# Altium project PCB_Project1.PrjPCB
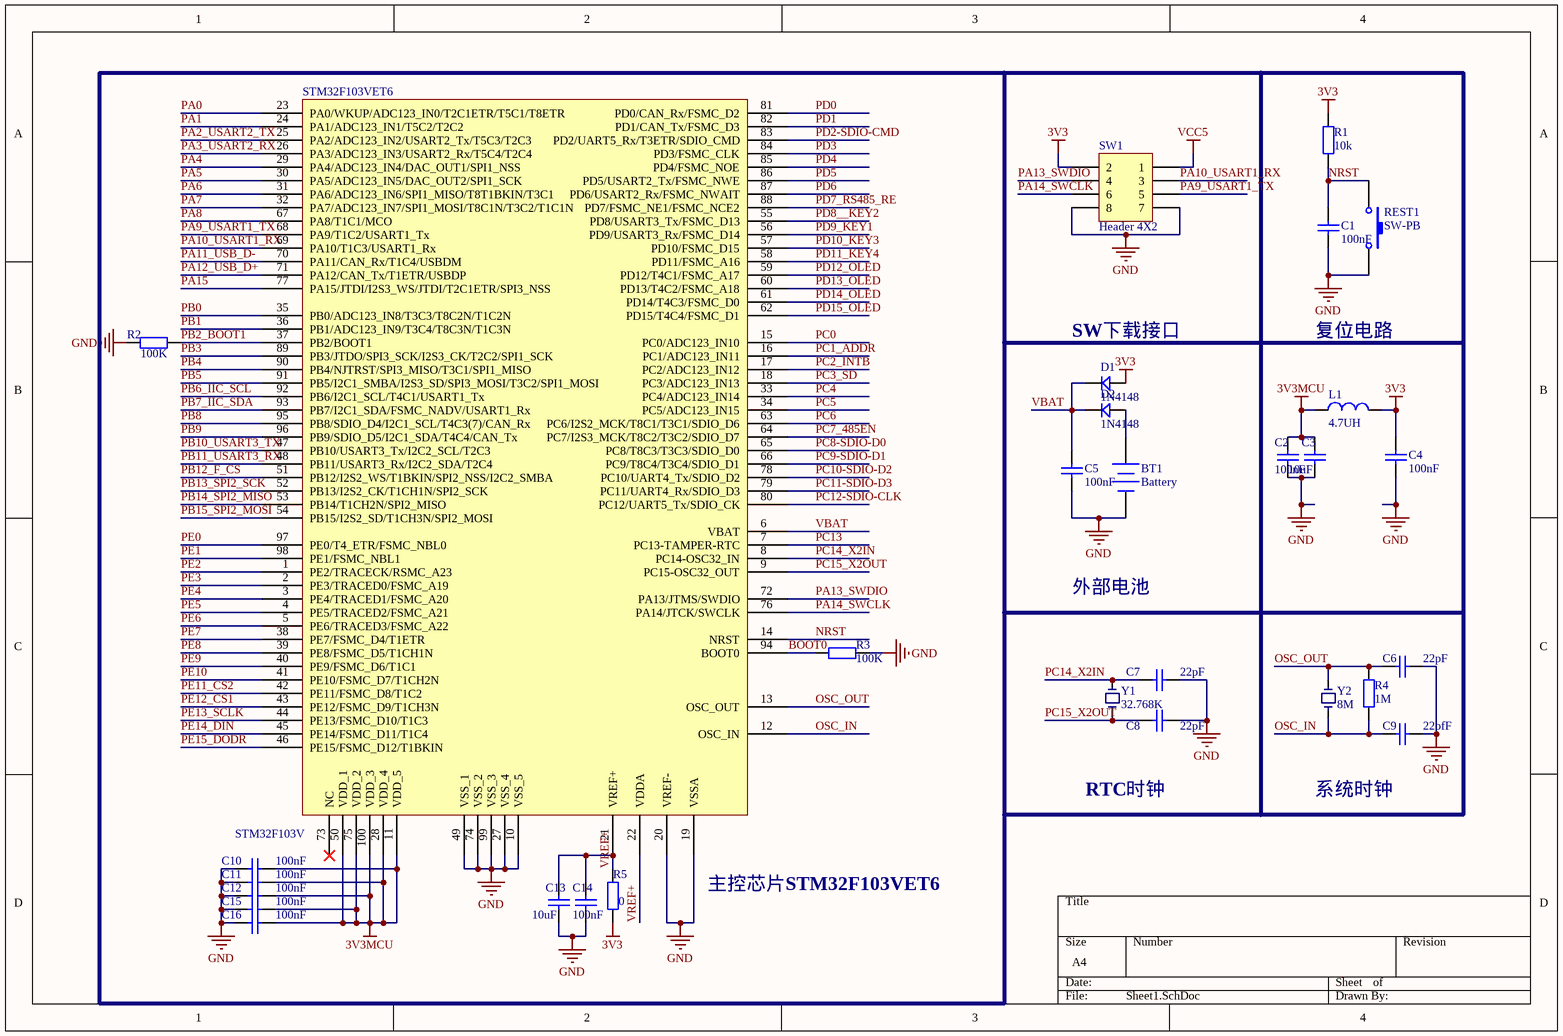
[diagram p0: Sheet1.SchDoc]
5 sheets, 202 parts. Net scope: global (net labels, ports and power ports of the same name join across sheets).
Board file: zhukong.PcbDoc
Sheets:
  Sheet1.SchDoc
  Sheet2.SchDoc
  Sheet3.SchDoc
  Sheet4.SchDoc
  Sheet5.SchDoc

## Sheet Sheet1.SchDoc
size A4

### Parts
BT1  Battery  [BATTERY_CR1220]
C1  100nF  [LC-0603_C]
C2  100nF  [LC-0603_C]
C3  10uF  [LC-0805_C]
C4  100nF  [LC-0603_C]
C5  100nF  [LC-0603_C]
C6  22pF  [LC-0603_C]
C7  22pF  [LC-0603_C]
C8  22pF  [LC-0603_C]
C9  22pfF  [LC-0603_C]
C10  100nF  [LC-0603_C]
C11  100nF  [LC-0603_C]
C12  100nF  [LC-0603_C]
C13  10uF  [LC-0805_C]
C14  100nF  [LC-0603_C]
C15  100nF  [LC-0603_C]
C16  100nF  [LC-0603_C]
D1  1N4148  [DIODE_SOP]
D2  1N4148  [DIODE_SOP]
L1  4.7UH  [LC-0805_L]
R1  10k  [LC-0603_R]
R2  100K  [LC-0603_R]
R3  100K  [LC-0603_R]
R4  1M  [LC-0603_R]
R5  0  [LC-0603_R]
REST1  SW-PB  [SW-SMD1]
STM32F103VET6  STM32F103V  [LQFP-100_M]
SW1  Header 4X2  [HDR2X4]
Y1  32.768K  [XTAL-长形 贴片]
Y2  8M  [XTAL 直插]

### Nets
3V3: C4.2 D1.1 L1.2 R1.1 R5.1 SW1.2
3V3MCU: C2.2 C3.2 C10.2 C11.2 C12.2 C15.2 C16.2 L1.1 STM32F103VET6.11(VDD_5) STM32F103VET6.28(VDD_4) STM32F103VET6.50(VDD_1) STM32F103VET6.75(VDD_2) STM32F103VET6.100(VDD_3)
GND: BT1.2(-) C1.2 C2.1 C3.1 C4.1 C5.1 C6.2 C7.2 C8.2 C9.2 C10.1 C11.1 C12.1 C13.1 C14.1 C15.1 C16.1 R2.2 R3.1 REST1.2 STM32F103VET6.10(VSS_5) STM32F103VET6.19(VSSA) STM32F103VET6.20(VREF-) STM32F103VET6.27(VSS_4) STM32F103VET6.49(VSS_1) STM32F103VET6.74(VSS_2) STM32F103VET6.99(VSS_3) SW1.7 SW1.8
VCC5: SW1.1
BOOT0: R3.2 STM32F103VET6.94(BOOT0)
NRST: C1.1 R1.2 REST1.1 STM32F103VET6.14(NRST)
OSC_IN: C9.1 R4.1 STM32F103VET6.12(OSC_IN) Y2.1
OSC_OUT: C6.1 R4.2 STM32F103VET6.13(OSC_OUT) Y2.2
PA0: STM32F103VET6.23(PA0/WKUP/ADC123_IN0/T2C1ETR/T5C1/T8ETR)
PA1: STM32F103VET6.24(PA1/ADC123_IN1/T5C2/T2C2)
PA2_USART2_TX: STM32F103VET6.25(PA2/ADC123_IN2/USART2_Tx/T5C3/T2C3)
PA3_USART2_RX: STM32F103VET6.26(PA3/ADC123_IN3/USART2_Rx/T5C4/T2C4)
PA4: STM32F103VET6.29(PA4/ADC123_IN4/DAC_OUT1/SPI1_NSS)
PA5: STM32F103VET6.30(PA5/ADC123_IN5/DAC_OUT2/SPI1_SCK)
PA6: STM32F103VET6.31(PA6/ADC123_IN6/SPI1_MISO/T8T1BKIN/T3C1)
PA7: STM32F103VET6.32(PA7/ADC123_IN7/SPI1_MOSI/T8C1N/T3C2/T1C1N)
PA8: STM32F103VET6.67(PA8/T1C1/MCO)
PA9_USART1_TX: STM32F103VET6.68(PA9/T1C2/USART1_Tx) SW1.5
PA10_USART1_RX: STM32F103VET6.69(PA10/T1C3/USART1_Rx) SW1.3
PA11_USB_D-: STM32F103VET6.70(PA11/CAN_Rx/T1C4/USBDM)
PA12_USB_D+: STM32F103VET6.71(PA12/CAN_Tx/T1ETR/USBDP)
PA13_SWDIO: STM32F103VET6.72(PA13/JTMS/SWDIO) SW1.4
PA14_SWCLK: STM32F103VET6.76(PA14/JTCK/SWCLK) SW1.6
PA15: STM32F103VET6.77(PA15/JTDI/I2S3_WS/JTDI/T2C1ETR/SPI3_NSS)
PB0: STM32F103VET6.35(PB0/ADC123_IN8/T3C3/T8C2N/T1C2N)
PB1: STM32F103VET6.36(PB1/ADC123_IN9/T3C4/T8C3N/T1C3N)
PB2_BOOT1: R2.1 STM32F103VET6.37(PB2/BOOT1)
PB3: STM32F103VET6.89(PB3/JTDO/SPI3_SCK/I2S3_CK/T2C2/SPI1_SCK)
PB4: STM32F103VET6.90(PB4/NJTRST/SPI3_MISO/T3C1/SPI1_MISO)
PB5: STM32F103VET6.91(PB5/I2C1_SMBA/I2S3_SD/SPI3_MOSI/T3C2/SPI1_MOSI)
PB6_IIC_SCL: STM32F103VET6.92(PB6/I2C1_SCL/T4C1/USART1_Tx)
PB7_IIC_SDA: STM32F103VET6.93(PB7/I2C1_SDA/FSMC_NADV/USART1_Rx)
PB8: STM32F103VET6.95(PB8/SDIO_D4/I2C1_SCL/T4C3(7)/CAN_Rx)
PB9: STM32F103VET6.96(PB9/SDIO_D5/I2C1_SDA/T4C4/CAN_Tx)
PB10_USART3_TX: STM32F103VET6.47(PB10/USART3_Tx/I2C2_SCL/T2C3)
PB11_USART3_RX: STM32F103VET6.48(PB11/USART3_Rx/I2C2_SDA/T2C4)
PB12_F_CS: STM32F103VET6.51(PB12/I2S2_WS/T1BKIN/SPI2_NSS/I2C2_SMBA)
PB13_SPI2_SCK: STM32F103VET6.52(PB13/I2S2_CK/T1CH1N/SPI2_SCK)
PB14_SPI2_MISO: STM32F103VET6.53(PB14/T1CH2N/SPI2_MISO)
PB15_SPI2_MOSI: STM32F103VET6.54(PB15/I2S2_SD/T1CH3N/SPI2_MOSI)
PC0: STM32F103VET6.15(PC0/ADC123_IN10)
PC1_ADDR: STM32F103VET6.16(PC1/ADC123_IN11)
PC2_INTB: STM32F103VET6.17(PC2/ADC123_IN12)
PC3_SD: STM32F103VET6.18(PC3/ADC123_IN13)
PC4: STM32F103VET6.33(PC4/ADC123_IN14)
PC5: STM32F103VET6.34(PC5/ADC123_IN15)
PC6: STM32F103VET6.63(PC6/I2S2_MCK/T8C1/T3C1/SDIO_D6)
PC7_485EN: STM32F103VET6.64(PC7/I2S3_MCK/T8C2/T3C2/SDIO_D7)
PC8-SDIO-D0: STM32F103VET6.65(PC8/T8C3/T3C3/SDIO_D0)
PC9-SDIO-D1: STM32F103VET6.66(PC9/T8C4/T3C4/SDIO_D1)
PC10-SDIO-D2: STM32F103VET6.78(PC10/UART4_Tx/SDIO_D2)
PC11-SDIO-D3: STM32F103VET6.79(PC11/UART4_Rx/SDIO_D3)
PC12-SDIO-CLK: STM32F103VET6.80(PC12/UART5_Tx/SDIO_CK)
PC13: STM32F103VET6.7(PC13-TAMPER-RTC)
PC14_X2IN: C7.1 STM32F103VET6.8(PC14-OSC32_IN) Y1.2
PC15_X2OUT: C8.1 STM32F103VET6.9(PC15-OSC32_OUT) Y1.1
PD0: STM32F103VET6.81(PD0/CAN_Rx/FSMC_D2)
PD1: STM32F103VET6.82(PD1/CAN_Tx/FSMC_D3)
PD2-SDIO-CMD: STM32F103VET6.83(PD2/UART5_Rx/T3ETR/SDIO_CMD)
PD3: STM32F103VET6.84(PD3/FSMC_CLK)
PD4: STM32F103VET6.85(PD4/FSMC_NOE)
PD5: STM32F103VET6.86(PD5/USART2_Tx/FSMC_NWE)
PD6: STM32F103VET6.87(PD6/USART2_Rx/FSMC_NWAIT)
PD7_RS485_RE: STM32F103VET6.88(PD7/FSMC_NE1/FSMC_NCE2)
PD8__KEY2: STM32F103VET6.55(PD8/USART3_Tx/FSMC_D13)
PD9_KEY1: STM32F103VET6.56(PD9/USART3_Rx/FSMC_D14)
PD10_KEY3: STM32F103VET6.57(PD10/FSMC_D15)
PD11_KEY4: STM32F103VET6.58(PD11/FSMC_A16)
PD12_OLED: STM32F103VET6.59(PD12/T4C1/FSMC_A17)
PD13_OLED: STM32F103VET6.60(PD13/T4C2/FSMC_A18)
PD14_OLED: STM32F103VET6.61(PD14/T4C3/FSMC_D0)
PD15_OLED: STM32F103VET6.62(PD15/T4C4/FSMC_D1)
PE0: STM32F103VET6.97(PE0/T4_ETR/FSMC_NBL0)
PE1: STM32F103VET6.98(PE1/FSMC_NBL1)
PE2: STM32F103VET6.1(PE2/TRACECK/RSMC_A23)
PE3: STM32F103VET6.2(PE3/TRACED0/FSMC_A19)
PE4: STM32F103VET6.3(PE4/TRACED1/FSMC_A20)
PE5: STM32F103VET6.4(PE5/TRACED2/FSMC_A21)
PE6: STM32F103VET6.5(PE6/TRACED3/FSMC_A22)
PE7: STM32F103VET6.38(PE7/FSMC_D4/T1ETR)
PE8: STM32F103VET6.39(PE8/FSMC_D5/T1CH1N)
PE9: STM32F103VET6.40(PE9/FSMC_D6/T1C1)
PE10: STM32F103VET6.41(PE10/FSMC_D7/T1CH2N)
PE11_CS2: STM32F103VET6.42(PE11/FSMC_D8/T1C2)
PE12_CS1: STM32F103VET6.43(PE12/FSMC_D9/T1CH3N)
PE13_SCLK: STM32F103VET6.44(PE13/FSMC_D10/T1C3)
PE14_DIN: STM32F103VET6.45(PE14/FSMC_D11/T1C4)
PE15_DODR: STM32F103VET6.46(PE15/FSMC_D12/T1BKIN)
VBAT: C5.2 D1.2 D2.2 STM32F103VET6.6(VBAT)
VREF+: C13.2 C14.2 R5.2 STM32F103VET6.21(VREF+) STM32F103VET6.22(VDDA)
NetBT1_1: BT1.1(+) D2.1

Not connected (* = marked no-connect by the designer): STM32F103VET6 73(NC)*

### Notes on the sheet
- (near D1) SW下载接口
- 复位电路
- 外部电池
- RTC时钟
- 系统时钟
- 主控芯片STM32F103VET6

### Library data of the parts
BT1 = Battery: 备份电池; Published: 24-Mar-1999; LatestRevisionDate: 17-Jul-2002; LatestRevisionNote: Re-released for DXP Platform.; PackageReference: BAT-2; Publisher: Altium Limited
C1 C2 C4-C12 C14-C16 = Cap: 无极性电容; Published: 8-Jun-2000; LatestRevisionDate: 17-Jul-2002; LatestRevisionNote: Re-released for DXP Platform.; PackageReference: RAD-0.3; Publisher: Altium Limited
C3 C13 = 0805 1.0pF (010) 0.25pF 50V: 贴片电容; ComponentLink1Description: 供应商链接; ComponentLink1URL: http://www.szlcsc.com/product/details_15644.html; Package: 0805; Supplier: LC; SuppliersPartNumber: C14971
D1 D2 = D
L1 = 电感
R1-R5 = Res1: 贴片电阻; Value: 1K; Published: 8-Jun-2000; LatestRevisionDate: 17-Jul-2002; LatestRevisionNote: Re-released for DXP Platform.; PackageReference: AXIAL-0.4; Publisher: Altium Limited
REST1 = SW-PB: Switch; Published: 24-Mar-1999; LatestRevisionDate: 17-Jul-2002; LatestRevisionNote: Re-released for DXP Platform.; PackageReference: SPST-2; Publisher: Altium Limited; PackageDescription: Switch; 2 Leads
STM32F103VET6 = STM32F103V: STM32单片机100引脚
SW1 = Header 4X2: Header, 4-Pin, Dual row; LatestRevisionDate: 17-Jul-2002; LatestRevisionNote: Re-released for DXP Platform.; Publisher: Altium Limited
Y1 Y2 = 晶振

## Sheet Sheet2.SchDoc
size A4
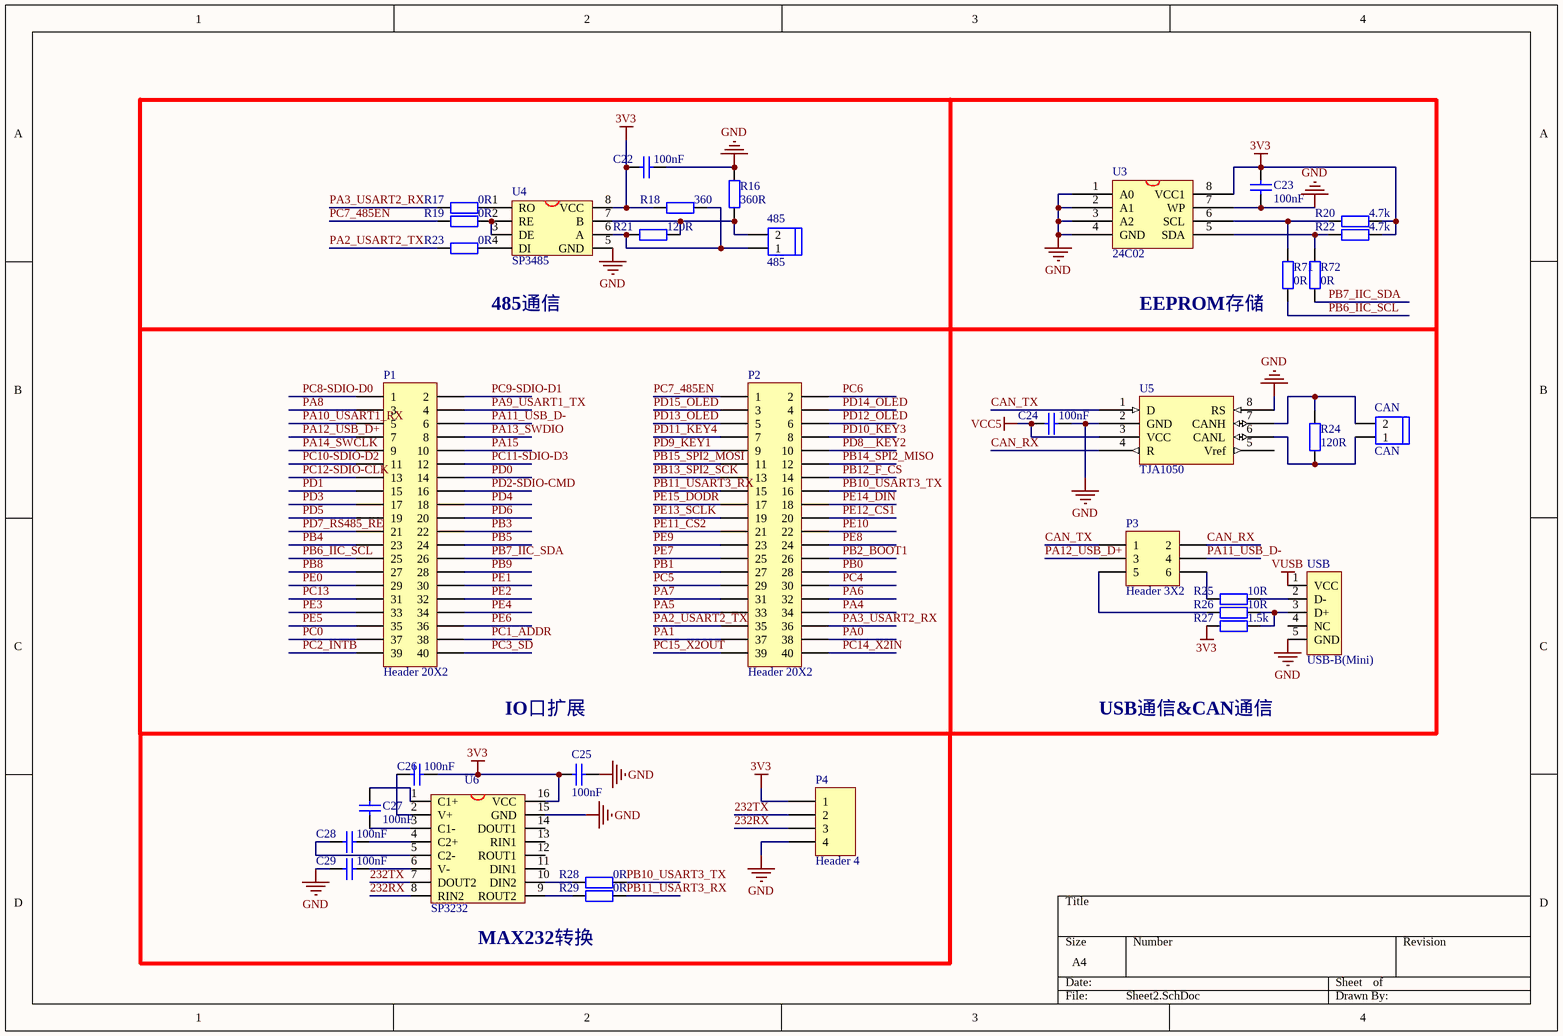
[diagram p1: Sheet2.SchDoc]

### Parts
485  485  [HEAD2L-0.8]
C22  100nF  [LC-0603_C]
C23  100nF  [LC-0603_C]
C24  100nF  [LC-0603_C]
C25  100nF  [LC-0603_C]
C26  100nF  [LC-0603_C]
C27  100nF  [LC-0603_C]
C28  100nF  [LC-0603_C]
C29  100nF  [LC-0603_C]
CAN  CAN  [CON_2_5.08B]
P1  Header 20X2  [HDR2X20]
P2  Header 20X2  [HDR2X20]
P3  Header 3X2  [HDR2X3]
P4  Header 4  [HDR1X4]
R16  360R  [LC-0603_R]
R17  0R  [LC-0603_R]
R18  360  [LC-0603_R]
R19  0R  [LC-0603_R]
R20  4.7k  [LC-0603_R]
R21  120R  [LC-0603_R]
R22  4.7k  [LC-0603_R]
R23  0R  [LC-0603_R]
R24  120R  [LC-0603_R]
R25  10R  [LC-0603_R]
R26  10R  [LC-0603_R]
R27  1.5k  [LC-0603_R]
R28  0R  [LC-0603_R]
R29  0R  [LC-0603_R]
R71  0R  [LC-0603_R]
R72  0R  [LC-0603_R]
U3  24C02  [SO-8]
U4  SP3485  [SO-8]
U5  TJA1050  [SO-8]
U6  SP3232  [SO-16]
USB  USB-B(Mini)  [USB/SM0.8-6H5]

### Nets
3V3: C22.1 C23.1 C25.2 C26.1 P4.1 R18.2 R20.1 R22.1 R27.1 U3.8(VCC1) U4.8(VCC) U6.16(VCC)
GND: C22.2 C23.2 C24.2 C25.1 C29.2 P4.4 R16.1 U3.1(A0) U3.2(A1) U3.3(A2) U3.4(GND) U3.7(WP) U4.5(GND) U5.2(GND) U5.8(RS) U6.15(GND) USB.5(GND)
VCC5: C24.1 U5.3(VCC)
VUSB: USB.1(VCC)
232RX: P4.3 U6.8(RIN2)
232TX: P4.2 U6.7(DOUT2)
CAN_RX: P3.2 U5.4(R)
CAN_TX: P3.1 U5.1(D)
PA0: P2.38
PA1: P2.37
PA2_USART2_TX: P2.35 R23.2
PA3_USART2_RX: P2.36 R17.2
PA4: P2.34
PA5: P2.33
PA6: P2.32
PA7: P2.31
PA8: P1.3
PA9_USART1_TX: P1.4
PA10_USART1_RX: P1.5
PA11_USB_D-: P1.6 P3.4
PA12_USB_D+: P1.7 P3.3
PA13_SWDIO: P1.8
PA14_SWCLK: P1.9
PA15: P1.10
PB0: P2.28
PB1: P2.27
PB2_BOOT1: P2.26
PB3: P1.22
PB4: P1.23
PB5: P1.24
PB6_IIC_SCL: P1.25 R71.1
PB7_IIC_SDA: P1.26 R72.1
PB8: P1.27
PB9: P1.28
PB10_USART3_TX: P2.16 R28.1
PB11_USART3_RX: P2.15 R29.1
PB12_F_CS: P2.14
PB13_SPI2_SCK: P2.13
PB14_SPI2_MISO: P2.12
PB15_SPI2_MOSI: P2.11
PC0: P1.37
PC1_ADDR: P1.38
PC2_INTB: P1.39
PC3_SD: P1.40
PC4: P2.30
PC5: P2.29
PC6: P2.2
PC7_485EN: P2.1 R19.2
PC8-SDIO-D0: P1.1
PC9-SDIO-D1: P1.2
PC10-SDIO-D2: P1.11
PC11-SDIO-D3: P1.12
PC12-SDIO-CLK: P1.13
PC13: P1.31
PC14_X2IN: P2.40
PC15_X2OUT: P2.39
PD0: P1.14
PD1: P1.15
PD2-SDIO-CMD: P1.16
PD3: P1.17
PD4: P1.18
PD5: P1.19
PD6: P1.20
PD7_RS485_RE: P1.21
PD8__KEY2: P2.10
PD9_KEY1: P2.9
PD10_KEY3: P2.8
PD11_KEY4: P2.7
PD12_OLED: P2.6
PD13_OLED: P2.5
PD14_OLED: P2.4
PD15_OLED: P2.3
PE0: P1.29
PE1: P1.30
PE2: P1.32
PE3: P1.33
PE4: P1.34
PE5: P1.35
PE6: P1.36
PE7: P2.25
PE8: P2.24
PE9: P2.23
PE10: P2.22
PE11_CS2: P2.21
PE12_CS1: P2.20
PE13_SCLK: P2.19
PE14_DIN: P2.18
PE15_DODR: P2.17
Net485_1: 485.1 R18.1 R21.2 U4.6(A)
Net485_2: 485.2 R16.2 R21.1 U4.7(B)
NetC26_2: C26.2 U6.2(V+)
NetC27_1: C27.1 U6.3(C1-)
NetC27_2: C27.2 U6.1(C1+)
NetC28_1: C28.1 U6.5(C2-)
NetC28_2: C28.2 U6.4(C2+)
NetC29_1: C29.1 U6.6(V-)
NetCAN_1: CAN.1 R24.2 U5.6(CANL)
NetCAN_2: CAN.2 R24.1 U5.7(CANH)
NetP3_5: P3.5 R26.1
NetP3_6: P3.6 R25.1
NetR17_1: R17.1 U4.1(RO)
NetR19_1: R19.1 U4.2(RE) U4.3(DE)
NetR20_2: R20.2 R71.2 U3.6(SCL)
NetR22_2: R22.2 R72.2 U3.5(SDA)
NetR23_1: R23.1 U4.4(DI)
NetR25_2: R25.2 USB.2(D-)
NetR26_2: R26.2 R27.2 USB.3(D+)
NetR28_2: R28.2 U6.10(DIN2)
NetR29_2: R29.2 U6.9(ROUT2)

Not connected (* = marked no-connect by the designer): U5 5(Vref); U6 11(DIN1) 12(ROUT1) 13(RIN1) 14(DOUT1); USB 4(NC)

### Notes on the sheet
- 485通信
- EEPROM存储
- IO口扩展
- USB通信&CAN通信
- MAX232转换

### Library data of the parts
485 CAN = HEAD2
C22-C29 = Cap: 无极性电容; Published: 8-Jun-2000; LatestRevisionDate: 17-Jul-2002; LatestRevisionNote: Re-released for DXP Platform.; PackageReference: RAD-0.3; Publisher: Altium Limited
P1 P2 = Header 20X2: Header, 20-Pin, Dual row; LatestRevisionDate: 17-Jul-2002; LatestRevisionNote: Re-released for DXP Platform.; Publisher: Altium Limited
P3 = Header 3X2: Header, 3-Pin, Dual row; LatestRevisionDate: 17-Jul-2002; LatestRevisionNote: Re-released for DXP Platform.; Publisher: Altium Limited
P4 = Header 4: Header, 4-Pin; LatestRevisionDate: 17-Jul-2002; LatestRevisionNote: Re-released for DXP Platform.; Publisher: Altium Limited
R16-R29 = Res1: 贴片电阻; Value: 1K; Published: 8-Jun-2000; LatestRevisionDate: 17-Jul-2002; LatestRevisionNote: Re-released for DXP Platform.; PackageReference: AXIAL-0.4; Publisher: Altium Limited
R71 R72 = 0603 1.5KΩ (1501) 1%: 贴片电阻; ComponentLink1Description: 供应商链接; ComponentLink1URL: http://www.szlcsc.com/product/details_23570.html; Package: 0603; Supplier: LC; SuppliersPartNumber: C22843
U3 = 24C256
U4 = MAX3485
U5 = SN65HVD230D
U6 = MAX3232
USB = USB5

## Sheet Sheet3.SchDoc
size A4
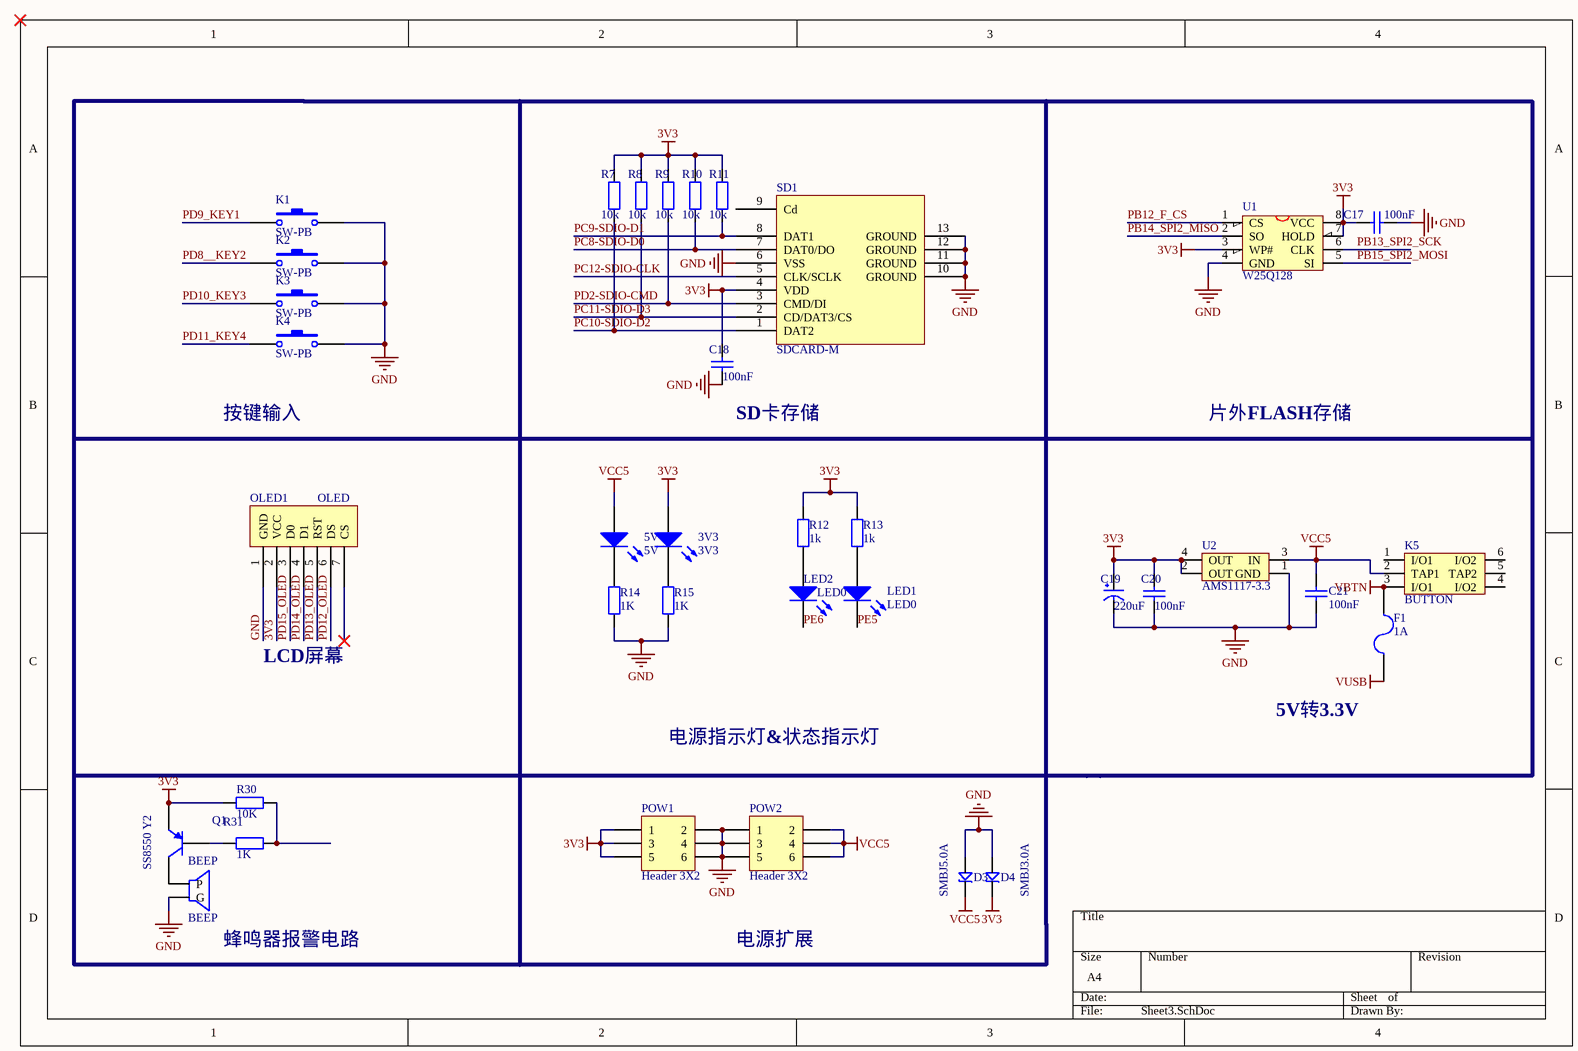
[diagram p2: Sheet3.SchDoc]

### Parts
3V3  3V3  [LED_0805]
5V  5V  [LED_0805]
BEEP  BEEP  [BUZZER]
C17  100nF  [LC-0603_C]
C18  100nF  [LC-0603_C]
C19  220uF  [CAP_10*10]
C20  100nF  [LC-0603_C]
C21  100nF  [LC-0603_C]
D3  SMBJ5.0A  [D1812]
D4  SMBJ3.0A  [D1812]
F1  value 1A  [LC-1206_R]  (hidden comment: Fuse)
K1  SW-PB  [SW-SMD1]
K2  SW-PB  [SW-SMD1]
K3  SW-PB  [SW-SMD1]
K4  SW-PB  [SW-SMD1]
K5  BUTTON  [DPDT]
LED1  LED0  [LED_0805]
LED2  LED0  [LED_0805]
OLED1  OLED  [OLED_096]
POW1  Header 3X2  [HDR2X3]
POW2  Header 3X2  [HDR2X3]
Q1  SS8550 Y2  [LC-SOT-23(SOT-23-3)]
R7  10k  [LC-0603_R]
R8  10k  [LC-0603_R]
R9  10k  [LC-0603_R]
R10  10k  [LC-0603_R]
R11  10k  [LC-0603_R]
R12  1k  [LC-0603_R]
R13  1k  [LC-0603_R]
R14  1K  [LC-0603_R]
R15  1K  [LC-0603_R]
R30  10K  [LC-0603_R]
R31  1K  [LC-0603_R]
SD1  SDCARD-M  [TF_CARD]
U1  W25Q128  [SOIC-8]
U2  AMS1117-3.3  [SOT-233]

### Nets
3V3: 3V3.1(A) C17.2 C18.2 C19.1(VCC) C20.2 D4.2 OLED1.2(VCC) POW1.1 POW1.3 POW1.5 Q1.2(E) R7.1 R8.1 R9.1 R10.1 R11.1 R12.1 R13.1 R30.2 SD1.4(VDD) U1.3(WP#) U1.7(HOLD) U1.8(VCC) U2.2(OUT) U2.4(OUT)
GND: BEEP.2(G) C17.1 C18.1 C19.2(GND) C20.1 C21.1 D3.1 D4.1 K1.2 K2.2 K3.2 K4.2 OLED1.1(GND) POW1.2 POW1.4 POW1.6 POW2.1 POW2.3 POW2.5 R14.1 R15.1 SD1.6(VSS) SD1.10(GROUND) SD1.11(GROUND) SD1.12(GROUND) SD1.13(GROUND) U1.4(GND) U2.1(GND)
VBTN: F1.2 K5.3(I/O1)
VCC5: 5V.1(A) C21.2 D3.2 K5.2(TAP1) POW2.2 POW2.4 POW2.6 U2.3(IN)
VUSB: F1.1
PB12_F_CS: U1.1(CS)
PB13_SPI2_SCK: U1.6(CLK)
PB14_SPI2_MISO: U1.2(SO)
PB15_SPI2_MOSI: U1.5(SI)
PC8-SDIO-D0: R10.2 SD1.7(DAT0/DO)
PC9-SDIO-D1: R11.2 SD1.8(DAT1)
PC10-SDIO-D2: R7.2 SD1.1(DAT2)
PC11-SDIO-D3: R8.2 SD1.2(CD/DAT3/CS)
PC12-SDIO-CLK: SD1.5(CLK/SCLK)
PD2-SDIO-CMD: R9.2 SD1.3(CMD/DI)
PD8__KEY2: K2.1
PD9_KEY1: K1.1
PD10_KEY3: K3.1
PD11_KEY4: K4.1
PD12_OLED: OLED1.6(DS)
PD13_OLED: OLED1.5(RST)
PD14_OLED: OLED1.4(D1)
PD15_OLED: OLED1.3(D0)
PE5: LED1.2(K)
PE6: LED2.2(K)
Net3V3_2: 3V3.2(K) R15.2
Net5V_2: 5V.2(K) R14.2
NetBEEP_1: BEEP.1(P) Q1.3(C)
NetLED1_1: LED1.1(A) R13.2
NetLED2_1: LED2.1(A) R12.2
NetQ1_1: Q1.1(B) R31.2
NetR30_1: R30.1 R31.1

Not connected (* = marked no-connect by the designer): K5 1(I/O1) 4(I/O2) 5(TAP2) 6(I/O2); OLED1 7(CS)*; SD1 9(Cd)

### Notes on the sheet
- 按键输入
- (near C18) SD卡存储
- 片外FLASH存储
- LCD屏幕
- 5V转3.3V
- 电源指示灯&状态指示灯
- (near BEEP) 蜂鸣器报警电路
- 电源扩展

### Library data of the parts
3V3 5V LED1 LED2 = LED0: Typical INFRARED GaAs LED; Published: 8-Jun-2000; LatestRevisionDate: 08-Jul-2005; LatestRevisionNote: Mech Layer 1 removed.; PackageReference: LED-0; Publisher: Altium Limited
C17 C18 C20 C21 = Cap: 无极性电容; Published: 8-Jun-2000; LatestRevisionDate: 17-Jul-2002; LatestRevisionNote: Re-released for DXP Platform.; PackageReference: RAD-0.3; Publisher: Altium Limited
C19 = CAP
D3 D4 = SMBJ: TVS
F1 = Fuse 2: 保险丝; Published: 8-Jun-2000; LatestRevisionDate: 17-Jul-2002; LatestRevisionNote: Re-released for DXP Platform.; PackageReference: PIN-W2/E2.8; Publisher: Altium Limited
K1-K4 = SW-PB: Switch; Published: 24-Mar-1999; LatestRevisionDate: 17-Jul-2002; LatestRevisionNote: Re-released for DXP Platform.; PackageReference: SPST-2; Publisher: Altium Limited; PackageDescription: Switch; 2 Leads
OLED1 = OLED_SPI: OLED屏幕
POW1 POW2 = Header 3X2: Header, 3-Pin, Dual row; LatestRevisionDate: 17-Jul-2002; LatestRevisionNote: Re-released for DXP Platform.; Publisher: Altium Limited
Q1 = SOT-23 SS8550 Y2: 三极管; ComponentLink1Description: 供应商链接; ComponentLink1URL: http://www.szlcsc.com/product/details_9037.html; Package: SOT-23; Supplier: LC; SuppliersPartNumber: C8542
R7-R11 = Res1: 贴片电阻; Value: 1K; Published: 8-Jun-2000; LatestRevisionDate: 17-Jul-2002; LatestRevisionNote: Re-released for DXP Platform.; PackageReference: AXIAL-0.4; Publisher: Altium Limited
R12 R13 = Res1: 贴片电阻; Published: 8-Jun-2000; LatestRevisionDate: 17-Jul-2002; LatestRevisionNote: Re-released for DXP Platform.; PackageReference: AXIAL-0.4; Publisher: Altium Limited; Value: 1K
R14 R15 R30 R31 = 0603 1.1KΩ (1101) 1%: 贴片电阻; ComponentLink1Description: 供应商链接; ComponentLink1URL: http://www.szlcsc.com/product/details_23491.html; Package: 0603; Supplier: LC; SuppliersPartNumber: C22764
SD1 = SDCARD-M: TF卡槽
U1 = W25X16: W25X16;SST25VF016;MX25L1605
U2 = AMS1117

## Sheet Sheet4.SchDoc
size A4
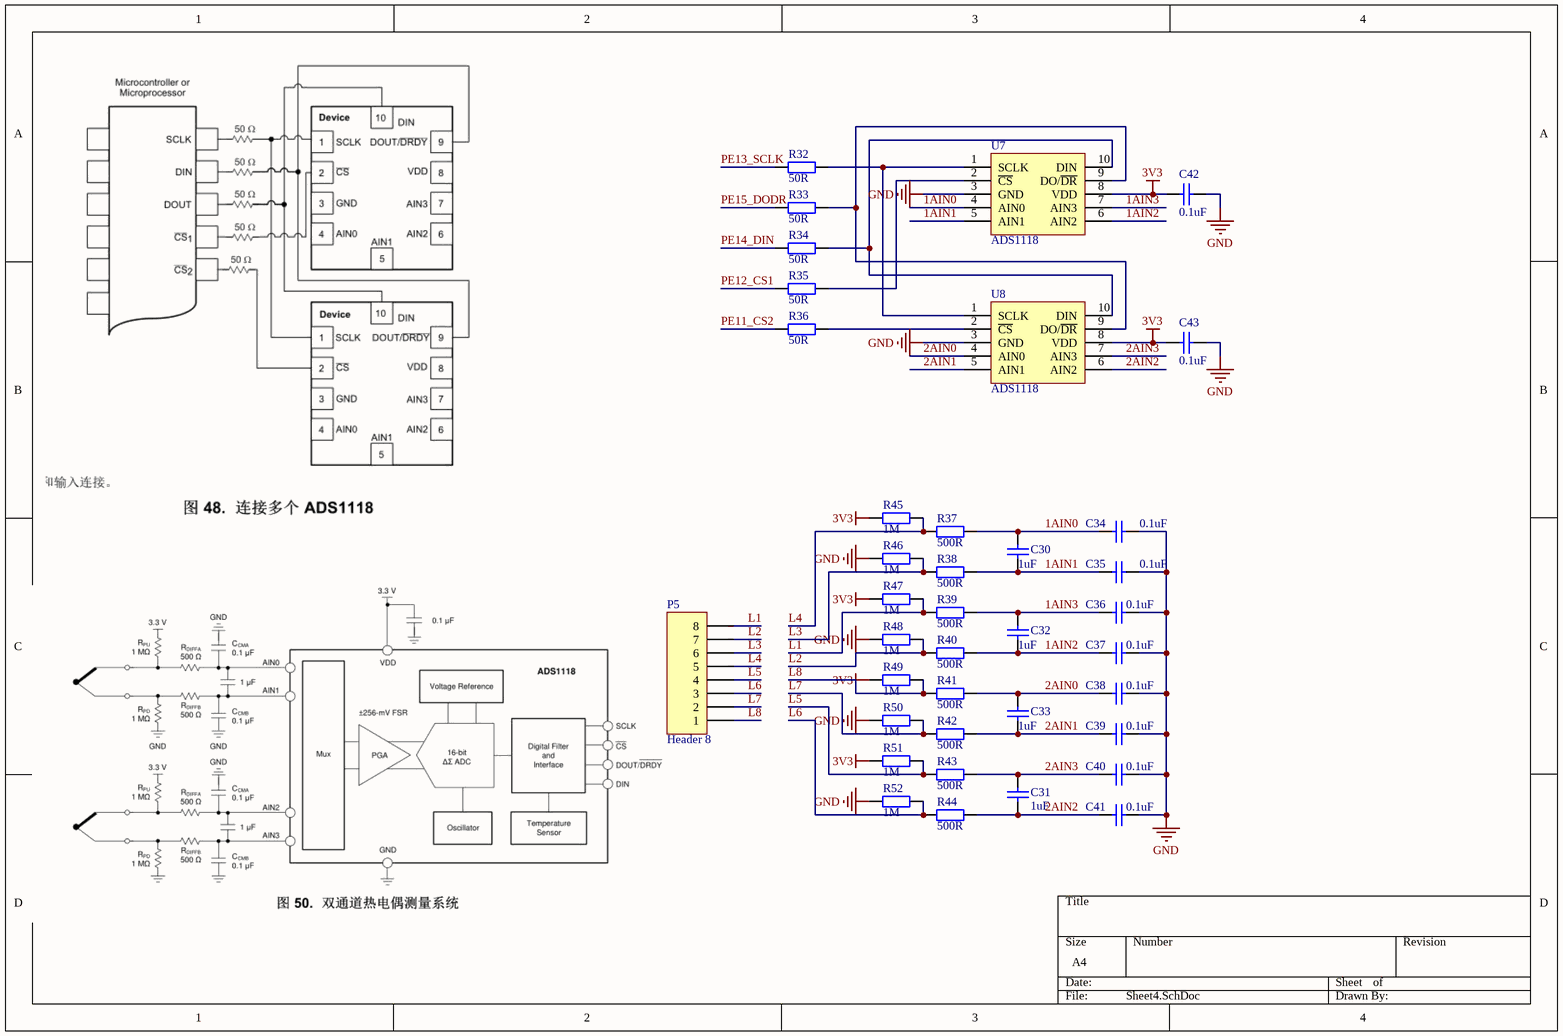
[diagram p3: Sheet4.SchDoc]

### Parts
C30  1uF  [LC-0603_C]
C31  1uF  [LC-0603_C]
C32  1uF  [LC-0603_C]
C33  1uF  [LC-0603_C]
C34  0.1uF  [LC-0603_C]
C35  0.1uF  [LC-0603_C]
C36  0.1uF  [LC-0603_C]
C37  0.1uF  [LC-0603_C]
C38  0.1uF  [LC-0603_C]
C39  0.1uF  [LC-0603_C]
C40  0.1uF  [LC-0603_C]
C41  0.1uF  [LC-0603_C]
C42  0.1uF  [LC-0603_C]
C43  0.1uF  [LC-0603_C]
P5  Header 8  [HDR1X8]
R32  50R  [LC-0603_R]
R33  50R  [LC-0603_R]
R34  50R  [LC-0603_R]
R35  50R  [LC-0603_R]
R36  50R  [LC-0603_R]
R37  500R  [LC-0603_R]
R38  500R  [LC-0603_R]
R39  500R  [LC-0603_R]
R40  500R  [LC-0603_R]
R41  500R  [LC-0603_R]
R42  500R  [LC-0603_R]
R43  500R  [LC-0603_R]
R44  500R  [LC-0603_R]
R45  1M  [LC-0603_R]
R46  1M  [LC-0603_R]
R47  1M  [LC-0603_R]
R48  1M  [LC-0603_R]
R49  1M  [LC-0603_R]
R50  1M  [LC-0603_R]
R51  1M  [LC-0603_R]
R52  1M  [LC-0603_R]
U7  ADS1118  [SOP-10]
U8  ADS1118  [SOP-10]

### Nets
3V3: C42.1 C43.1 R45.1 R47.1 R49.1 R51.1 U7.8(VDD) U8.8(VDD)
GND: C34.2 C35.2 C36.2 C37.2 C38.2 C39.2 C40.2 C41.2 C42.2 C43.2 R46.1 R48.1 R50.1 R52.1 U7.3(GND) U8.3(GND)
1AIN0: C30.2 C34.1 R37.2 U7.4(AIN0)
1AIN1: C30.1 C35.1 R38.2 U7.5(AIN1)
1AIN2: C32.1 C37.1 R40.2 U7.6(AIN2)
1AIN3: C32.2 C36.1 R39.2 U7.7(AIN3)
2AIN0: C33.2 C38.1 R41.2 U8.4(AIN0)
2AIN1: C33.1 C39.1 R42.2 U8.5(AIN1)
2AIN2: C31.1 C41.1 R44.2 U8.6(AIN2)
2AIN3: C31.2 C40.1 R43.2 U8.7(AIN3)
L1: P5.8 R39.1 R47.2
L2: P5.7 R40.1 R48.2
L3: P5.6 R38.1 R46.2
L4: P5.5 R37.1 R45.2
L5: P5.4 R43.1 R51.2
L6: P5.3 R44.1 R52.2
L7: P5.2 R42.1 R50.2
L8: P5.1 R41.1 R49.2
PE11_CS2: R36.1
PE12_CS1: R35.1
PE13_SCLK: R32.1
PE14_DIN: R34.1
PE15_DODR: R33.1
NetR32_2: R32.2 U7.1(SCLK) U8.1(SCLK)
NetR33_2: R33.2 U7.9(DO/~{DR}) U8.9(DO/~{DR})
NetR34_2: R34.2 U7.10(DIN) U8.10(DIN)
NetR35_2: R35.2 U7.2(~{CS})
NetR36_2: R36.2 U8.2(~{CS})

### Library data of the parts
C30-C43 = 0603 1uF (105) 10% 50V: 贴片电容; ComponentLink1Description: 供应商链接; ComponentLink1URL: http://www.szlcsc.com/product/details_16531.html; Package: 0603; Supplier: LC; SuppliersPartNumber: C15849
P5 = Header 8: Header, 8-Pin; LatestRevisionDate: 17-Jul-2002; LatestRevisionNote: Re-released for DXP Platform.; Publisher: Altium Limited
R32-R52 = 0603 1.5KΩ (1501) 1%: 贴片电阻; ComponentLink1Description: 供应商链接; ComponentLink1URL: http://www.szlcsc.com/product/details_23570.html; Package: 0603; Supplier: LC; SuppliersPartNumber: C22843
U7 U8 = ADS1118: AD采集芯片

## Sheet Sheet5.SchDoc
size A4
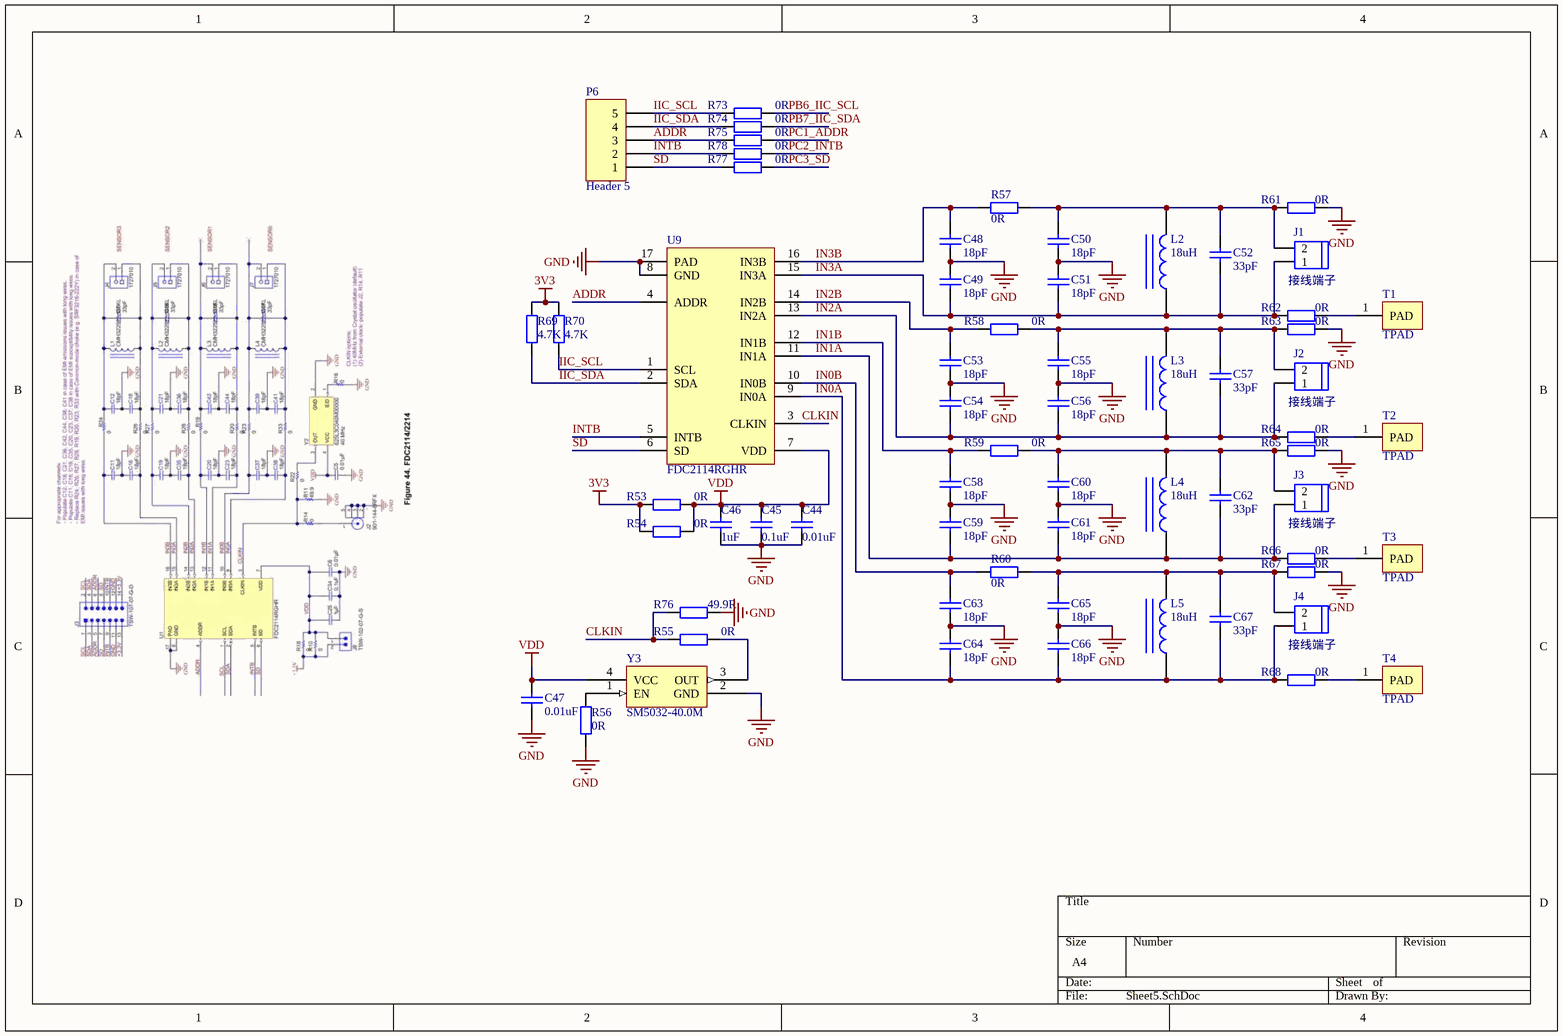
[diagram p4: Sheet5.SchDoc]

### Parts
C44  0.01uF  [LC-0603_C]
C45  0.1uF  [LC-0603_C]
C46  1uF  [LC-0603_C]
C47  0.01uF  [LC-0603_C]
C48  18pF  [LC-0603_C]
C49  18pF  [LC-0603_C]
C50  18pF  [LC-0603_C]
C51  18pF  [LC-0603_C]
C52  33pF  [LC-0603_C]
C53  18pF  [LC-0603_C]
C54  18pF  [LC-0603_C]
C55  18pF  [LC-0603_C]
C56  18pF  [LC-0603_C]
C57  33pF  [LC-0603_C]
C58  18pF  [LC-0603_C]
C59  18pF  [LC-0603_C]
C60  18pF  [LC-0603_C]
C61  18pF  [LC-0603_C]
C62  33pF  [LC-0603_C]
C63  18pF  [LC-0603_C]
C64  18pF  [LC-0603_C]
C65  18pF  [LC-0603_C]
C66  18pF  [LC-0603_C]
C67  33pF  [LC-0603_C]
J1  接线端子  [CON_2_5.08B]
J2  接线端子  [CON_2_5.08B]
J3  接线端子  [CON_2_5.08B]
J4  接线端子  [CON_2_5.08B]
L2  18uH  [LC-0805_L]
L3  18uH  [LC-0805_L]
L4  18uH  [LC-0805_L]
L5  18uH  [LC-0805_L]
P6  Header 5  [HDR1X5]
R53  0R  [LC-0603_R]
R54  0R  [LC-0603_R]
R55  0R  [LC-0603_R]
R56  0R  [LC-0603_R]
R57  0R  [LC-0603_R]
R58  0R  [LC-0603_R]
R59  0R  [LC-0603_R]
R60  0R  [LC-0603_R]
R61  0R  [LC-0603_R]
R62  0R  [LC-0603_R]
R63  0R  [LC-0603_R]
R64  0R  [LC-0603_R]
R65  0R  [LC-0603_R]
R66  0R  [LC-0603_R]
R67  0R  [LC-0603_R]
R68  0R  [LC-0603_R]
R69  4.7K  [LC-0603_R]
R70  4.7K  [LC-0603_R]
R73  0R  [LC-0603_R]
R74  0R  [LC-0603_R]
R75  0R  [LC-0603_R]
R76  49.9R  [LC-0603_R]
R77  0R  [LC-0603_R]
R78  0R  [LC-0603_R]
T1  TPAD  [TOUCH]
T2  TPAD  [TOUCH]
T3  TPAD  [TOUCH]
T4  TPAD  [TOUCH]
U9  FDC2114RGHR  [QFN16-05]
Y3  SM5032-40.0M  [XTAL_5032]

### Nets
3V3: R53.1 R54.1 R69.2 R70.2
GND: C44.1 C45.1 C46.1 C47.1 C48.1 C49.2 C50.1 C51.2 C53.1 C54.2 C55.1 C56.2 C58.1 C59.2 C60.1 C61.2 C63.1 C64.2 C65.1 C66.2 R56.1 R61.2 R63.2 R65.2 R67.2 R76.2 U9.8(GND) U9.17(PAD) Y3.2(GND)
VDD: C44.2 C45.2 C46.2 C47.2 R53.2 R54.2 U9.7(VDD) Y3.4(VCC)
ADDR: P6.3 R75.1 U9.4(ADDR)
CLKIN: R55.1 R76.1 U9.3(CLKIN)
IIC_SCL: P6.5 R70.1 R73.1 U9.1(SCL)
IIC_SDA: P6.4 R69.1 R74.1 U9.2(SDA)
IN0A: C64.1 C66.1 C67.1 J4.1 L5.1 R68.1 U9.9(IN0A)
IN0B: C63.2 R60.1 U9.10(IN0B)
IN1A: C59.1 C61.1 C62.1 J3.1 L4.1 R66.1 U9.11(IN1A)
IN1B: C58.2 R59.1 U9.12(IN1B)
IN2A: C54.1 C56.1 C57.1 J2.1 L3.1 R64.1 U9.13(IN2A)
IN2B: C53.2 R58.1 U9.14(IN2B)
IN3A: C49.1 C51.1 C52.1 J1.1 L2.1 R62.1 U9.15(IN3A)
IN3B: C48.2 R57.1 U9.16(IN3B)
INTB: P6.2 R78.1 U9.5(INTB)
PB6_IIC_SCL: R73.2
PB7_IIC_SDA: R74.2
PC1_ADDR: R75.2
PC2_INTB: R78.2
PC3_SD: R77.2
SD: P6.1 R77.1 U9.6(SD)
NetC50_2: C50.2 C52.2 J1.2 L2.2 R57.2 R61.1
NetC55_2: C55.2 C57.2 J2.2 L3.2 R58.2 R63.1
NetC60_2: C60.2 C62.2 J3.2 L4.2 R59.2 R65.1
NetC65_2: C65.2 C67.2 J4.2 L5.2 R60.2 R67.1
NetR55_2: R55.2 Y3.3(OUT)
NetR56_2: R56.2 Y3.1(EN)
NetR62_2: R62.2 T1.1(PAD)
NetR64_2: R64.2 T2.1(PAD)
NetR66_2: R66.2 T3.1(PAD)
NetR68_2: R68.2 T4.1(PAD)

### Library data of the parts
C44-C67 = 0603 1uF (105) 10% 50V: 贴片电容; ComponentLink1Description: 供应商链接; ComponentLink1URL: http://www.szlcsc.com/product/details_16531.html; Package: 0603; Supplier: LC; SuppliersPartNumber: C15849
J1-J4 = HEAD2
L2-L5 = 0805 47uH 10%: 贴片电感; ComponentLink1URL: http://www.szlcsc.com/product/details_14964.html; Package: 0805; Supplier: LC; SuppliersPartNumber: C14304
P6 = Header 5: Header, 5-Pin; LatestRevisionDate: 17-Jul-2002; LatestRevisionNote: Re-released for DXP Platform.; Publisher: Altium Limited
R53-R70 R73-R78 = 0603 1.5KΩ (1501) 1%: 贴片电阻; ComponentLink1Description: 供应商链接; ComponentLink1URL: http://www.szlcsc.com/product/details_23570.html; Package: 0603; Supplier: LC; SuppliersPartNumber: C22843
T1-T4 = TPAD: 触摸按键
U9 = FDC2114RGHR: 电容检测传感器
Y3 = SM5032: 有源晶振

## Nets that join several sheets
3V3: Sheet1 (6 pins), Sheet2 (12 pins), Sheet3 (25 pins), Sheet4 (8 pins), Sheet5 (R53.1 R54.1 R69.2 R70.2)
GND: Sheet1 (29 pins), Sheet2 (17 pins), Sheet3 (28 pins), Sheet4 (16 pins), Sheet5 (29 pins)
VCC5: Sheet1 (SW1.1), Sheet2 (C24.1 U5.3), Sheet3 (8 pins)
VUSB: Sheet2 (USB.1), Sheet3 (F1.1)
PA0: Sheet1 (STM32F103VET6.23), Sheet2 (P2.38)
PA1: Sheet1 (STM32F103VET6.24), Sheet2 (P2.37)
PA2_USART2_TX: Sheet1 (STM32F103VET6.25), Sheet2 (P2.35 R23.2)
PA3_USART2_RX: Sheet1 (STM32F103VET6.26), Sheet2 (P2.36 R17.2)
PA4: Sheet1 (STM32F103VET6.29), Sheet2 (P2.34)
PA5: Sheet1 (STM32F103VET6.30), Sheet2 (P2.33)
PA6: Sheet1 (STM32F103VET6.31), Sheet2 (P2.32)
PA7: Sheet1 (STM32F103VET6.32), Sheet2 (P2.31)
PA8: Sheet1 (STM32F103VET6.67), Sheet2 (P1.3)
PA9_USART1_TX: Sheet1 (STM32F103VET6.68 SW1.5), Sheet2 (P1.4)
PA10_USART1_RX: Sheet1 (STM32F103VET6.69 SW1.3), Sheet2 (P1.5)
PA11_USB_D-: Sheet1 (STM32F103VET6.70), Sheet2 (P1.6 P3.4)
PA12_USB_D+: Sheet1 (STM32F103VET6.71), Sheet2 (P1.7 P3.3)
PA13_SWDIO: Sheet1 (STM32F103VET6.72 SW1.4), Sheet2 (P1.8)
PA14_SWCLK: Sheet1 (STM32F103VET6.76 SW1.6), Sheet2 (P1.9)
PA15: Sheet1 (STM32F103VET6.77), Sheet2 (P1.10)
PB0: Sheet1 (STM32F103VET6.35), Sheet2 (P2.28)
PB1: Sheet1 (STM32F103VET6.36), Sheet2 (P2.27)
PB2_BOOT1: Sheet1 (R2.1 STM32F103VET6.37), Sheet2 (P2.26)
PB3: Sheet1 (STM32F103VET6.89), Sheet2 (P1.22)
PB4: Sheet1 (STM32F103VET6.90), Sheet2 (P1.23)
PB5: Sheet1 (STM32F103VET6.91), Sheet2 (P1.24)
PB6_IIC_SCL: Sheet1 (STM32F103VET6.92), Sheet2 (P1.25 R71.1), Sheet5 (R73.2)
PB7_IIC_SDA: Sheet1 (STM32F103VET6.93), Sheet2 (P1.26 R72.1), Sheet5 (R74.2)
PB8: Sheet1 (STM32F103VET6.95), Sheet2 (P1.27)
PB9: Sheet1 (STM32F103VET6.96), Sheet2 (P1.28)
PB10_USART3_TX: Sheet1 (STM32F103VET6.47), Sheet2 (P2.16 R28.1)
PB11_USART3_RX: Sheet1 (STM32F103VET6.48), Sheet2 (P2.15 R29.1)
PB12_F_CS: Sheet1 (STM32F103VET6.51), Sheet2 (P2.14), Sheet3 (U1.1)
PB13_SPI2_SCK: Sheet1 (STM32F103VET6.52), Sheet2 (P2.13), Sheet3 (U1.6)
PB14_SPI2_MISO: Sheet1 (STM32F103VET6.53), Sheet2 (P2.12), Sheet3 (U1.2)
PB15_SPI2_MOSI: Sheet1 (STM32F103VET6.54), Sheet2 (P2.11), Sheet3 (U1.5)
PC0: Sheet1 (STM32F103VET6.15), Sheet2 (P1.37)
PC1_ADDR: Sheet1 (STM32F103VET6.16), Sheet2 (P1.38), Sheet5 (R75.2)
PC2_INTB: Sheet1 (STM32F103VET6.17), Sheet2 (P1.39), Sheet5 (R78.2)
PC3_SD: Sheet1 (STM32F103VET6.18), Sheet2 (P1.40), Sheet5 (R77.2)
PC4: Sheet1 (STM32F103VET6.33), Sheet2 (P2.30)
PC5: Sheet1 (STM32F103VET6.34), Sheet2 (P2.29)
PC6: Sheet1 (STM32F103VET6.63), Sheet2 (P2.2)
PC7_485EN: Sheet1 (STM32F103VET6.64), Sheet2 (P2.1 R19.2)
PC8-SDIO-D0: Sheet1 (STM32F103VET6.65), Sheet2 (P1.1), Sheet3 (R10.2 SD1.7)
PC9-SDIO-D1: Sheet1 (STM32F103VET6.66), Sheet2 (P1.2), Sheet3 (R11.2 SD1.8)
PC10-SDIO-D2: Sheet1 (STM32F103VET6.78), Sheet2 (P1.11), Sheet3 (R7.2 SD1.1)
PC11-SDIO-D3: Sheet1 (STM32F103VET6.79), Sheet2 (P1.12), Sheet3 (R8.2 SD1.2)
PC12-SDIO-CLK: Sheet1 (STM32F103VET6.80), Sheet2 (P1.13), Sheet3 (SD1.5)
PC13: Sheet1 (STM32F103VET6.7), Sheet2 (P1.31)
PC14_X2IN: Sheet1 (C7.1 STM32F103VET6.8 Y1.2), Sheet2 (P2.40)
PC15_X2OUT: Sheet1 (C8.1 STM32F103VET6.9 Y1.1), Sheet2 (P2.39)
PD0: Sheet1 (STM32F103VET6.81), Sheet2 (P1.14)
PD1: Sheet1 (STM32F103VET6.82), Sheet2 (P1.15)
PD2-SDIO-CMD: Sheet1 (STM32F103VET6.83), Sheet2 (P1.16), Sheet3 (R9.2 SD1.3)
PD3: Sheet1 (STM32F103VET6.84), Sheet2 (P1.17)
PD4: Sheet1 (STM32F103VET6.85), Sheet2 (P1.18)
PD5: Sheet1 (STM32F103VET6.86), Sheet2 (P1.19)
PD6: Sheet1 (STM32F103VET6.87), Sheet2 (P1.20)
PD7_RS485_RE: Sheet1 (STM32F103VET6.88), Sheet2 (P1.21)
PD8__KEY2: Sheet1 (STM32F103VET6.55), Sheet2 (P2.10), Sheet3 (K2.1)
PD9_KEY1: Sheet1 (STM32F103VET6.56), Sheet2 (P2.9), Sheet3 (K1.1)
PD10_KEY3: Sheet1 (STM32F103VET6.57), Sheet2 (P2.8), Sheet3 (K3.1)
PD11_KEY4: Sheet1 (STM32F103VET6.58), Sheet2 (P2.7), Sheet3 (K4.1)
PD12_OLED: Sheet1 (STM32F103VET6.59), Sheet2 (P2.6), Sheet3 (OLED1.6)
PD13_OLED: Sheet1 (STM32F103VET6.60), Sheet2 (P2.5), Sheet3 (OLED1.5)
PD14_OLED: Sheet1 (STM32F103VET6.61), Sheet2 (P2.4), Sheet3 (OLED1.4)
PD15_OLED: Sheet1 (STM32F103VET6.62), Sheet2 (P2.3), Sheet3 (OLED1.3)
PE0: Sheet1 (STM32F103VET6.97), Sheet2 (P1.29)
PE1: Sheet1 (STM32F103VET6.98), Sheet2 (P1.30)
PE2: Sheet1 (STM32F103VET6.1), Sheet2 (P1.32)
PE3: Sheet1 (STM32F103VET6.2), Sheet2 (P1.33)
PE4: Sheet1 (STM32F103VET6.3), Sheet2 (P1.34)
PE5: Sheet1 (STM32F103VET6.4), Sheet2 (P1.35), Sheet3 (LED1.2)
PE6: Sheet1 (STM32F103VET6.5), Sheet2 (P1.36), Sheet3 (LED2.2)
PE7: Sheet1 (STM32F103VET6.38), Sheet2 (P2.25)
PE8: Sheet1 (STM32F103VET6.39), Sheet2 (P2.24)
PE9: Sheet1 (STM32F103VET6.40), Sheet2 (P2.23)
PE10: Sheet1 (STM32F103VET6.41), Sheet2 (P2.22)
PE11_CS2: Sheet1 (STM32F103VET6.42), Sheet2 (P2.21), Sheet4 (R36.1)
PE12_CS1: Sheet1 (STM32F103VET6.43), Sheet2 (P2.20), Sheet4 (R35.1)
PE13_SCLK: Sheet1 (STM32F103VET6.44), Sheet2 (P2.19), Sheet4 (R32.1)
PE14_DIN: Sheet1 (STM32F103VET6.45), Sheet2 (P2.18), Sheet4 (R34.1)
PE15_DODR: Sheet1 (STM32F103VET6.46), Sheet2 (P2.17), Sheet4 (R33.1)